# EasyEDA schematic SCH_ESP32.json
TITLE: Sheet_1; REV: 1.0; Date: 2026-06-26; Sheet: 1/1; Drawn By: bannuazmeera; Company: Your Company
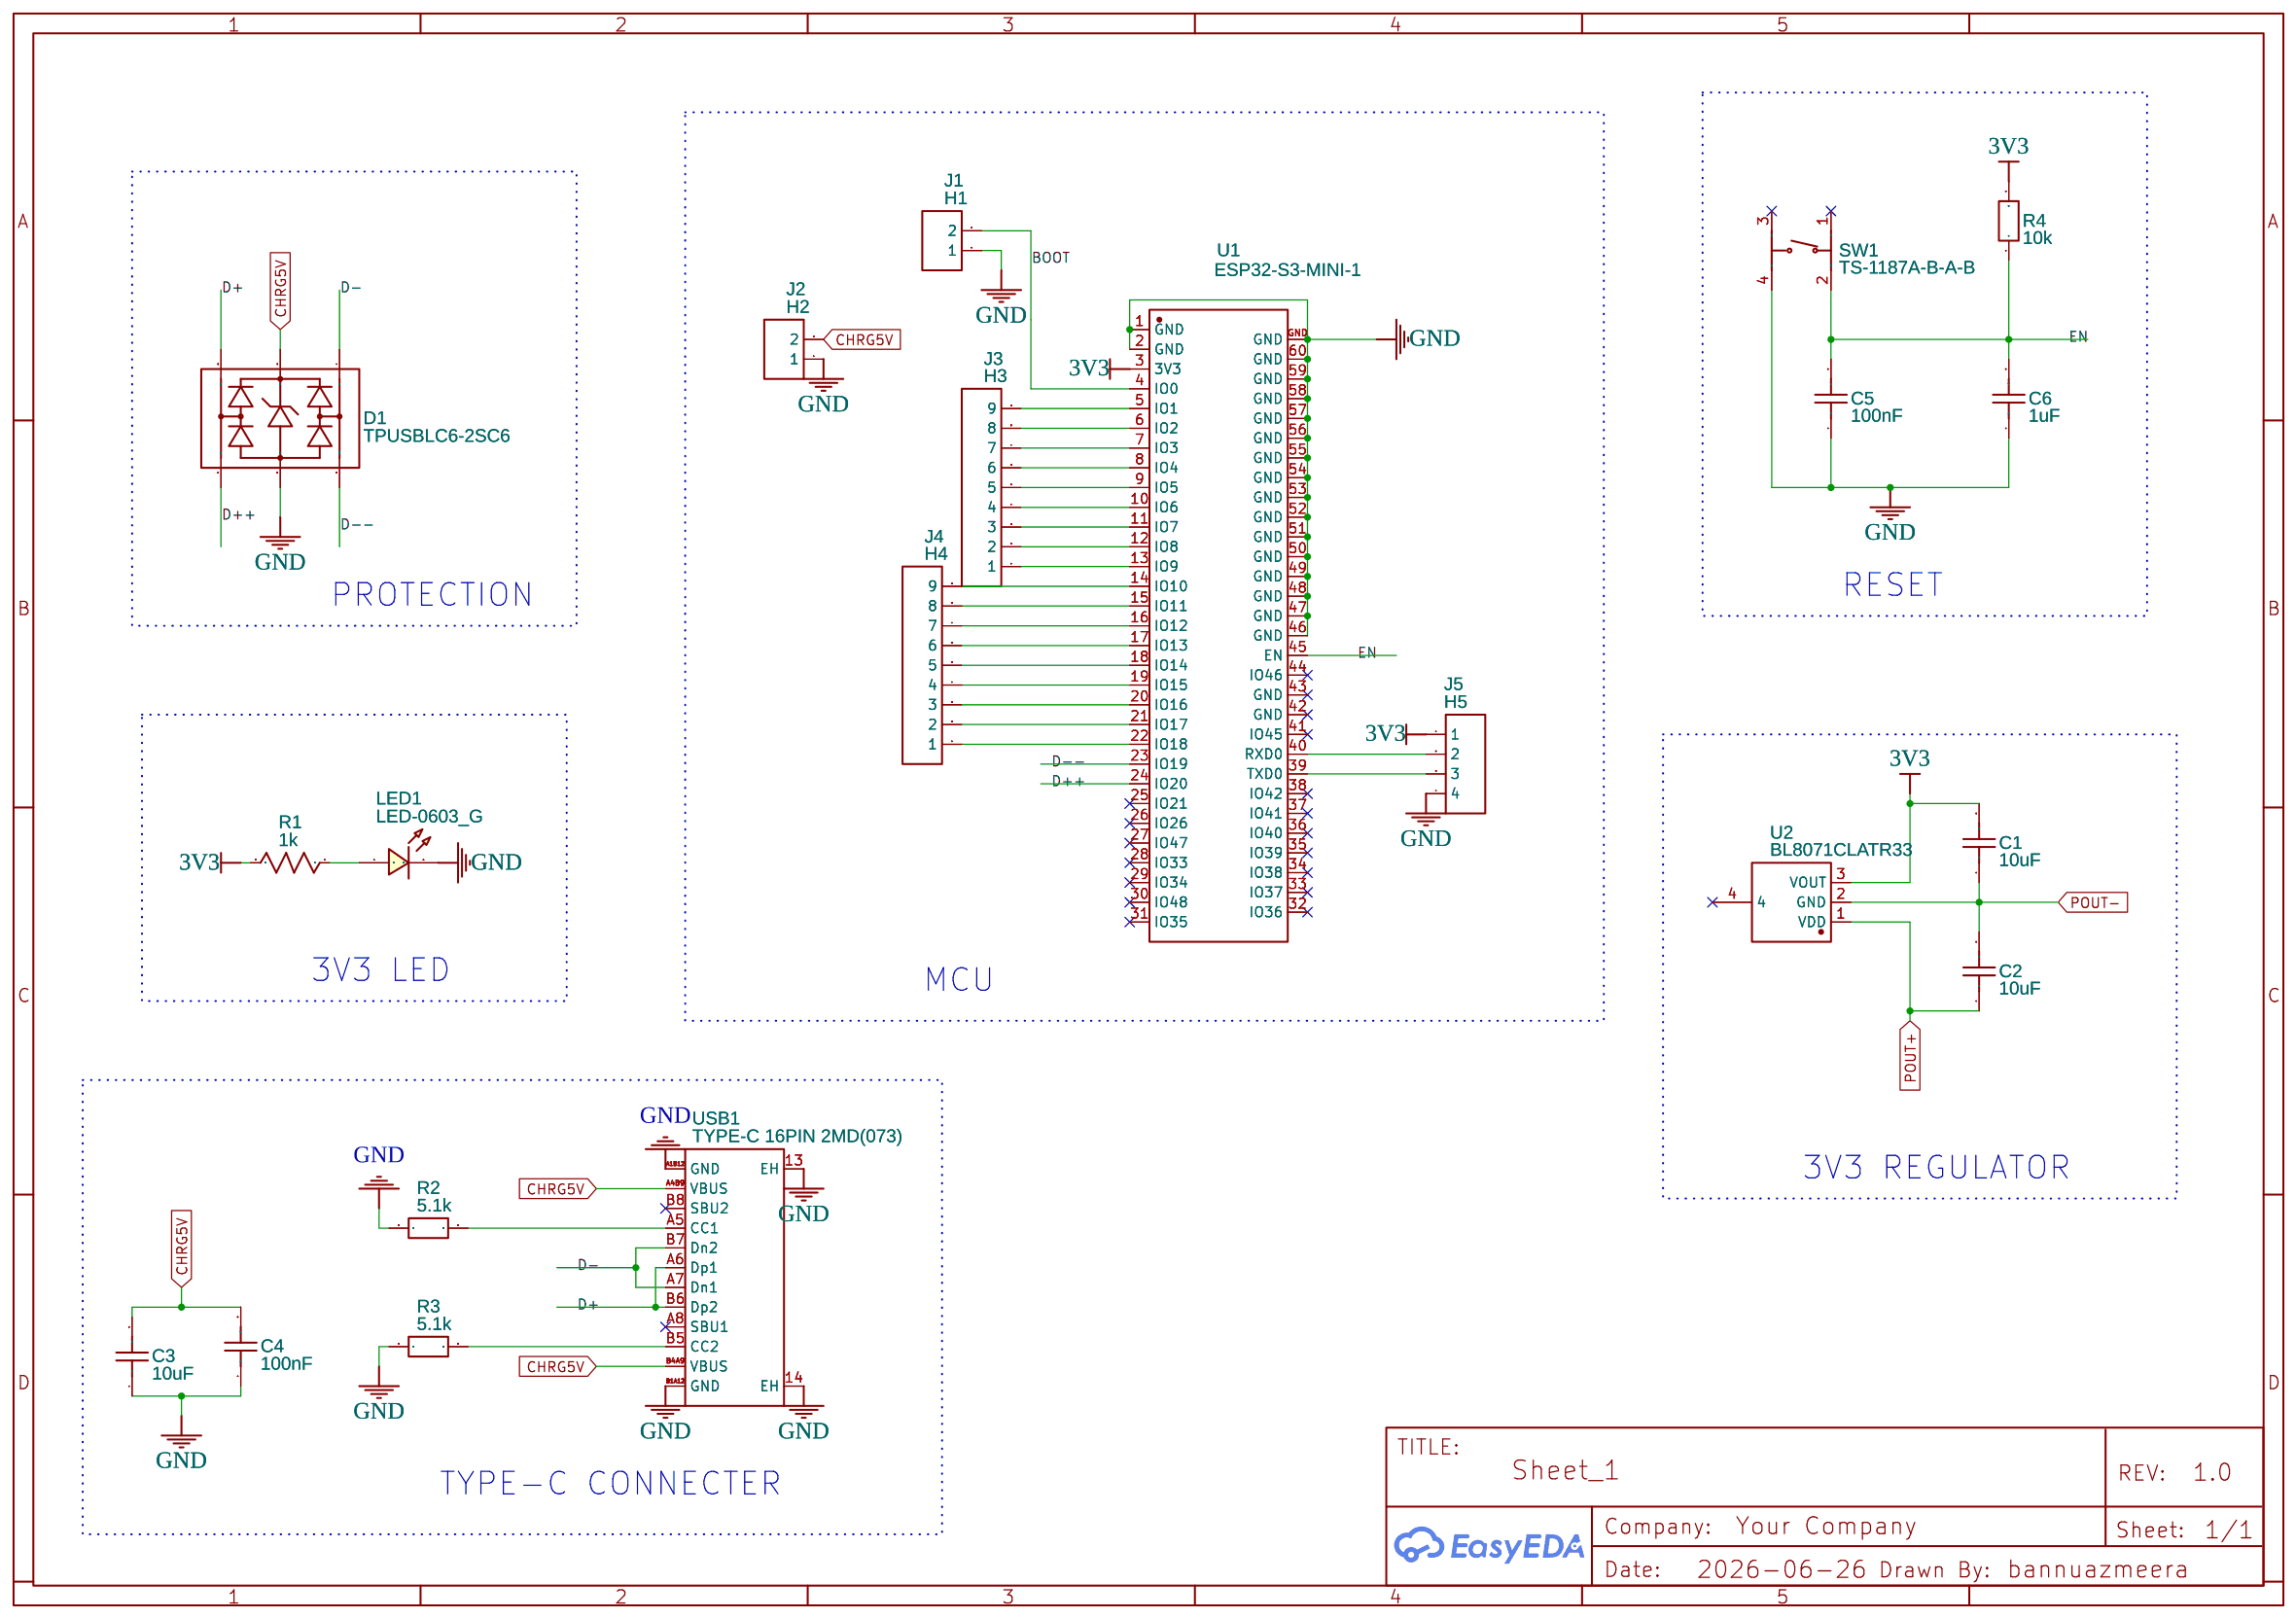
[diagram p0: schematic sheet]

## Parts
C1  10uF  [C0603]
C2  10uF  [C0603]
C3  10uF  [C0603]
C4  100nF  [C0603]
C5  100nF  [C0603]
C6  1uF  [C0603]
D1  TPUSBLC6-2SC6  [SOT-23-6_L2.9-W1.6-P0.95-LS2.8-BR]
J1  H1  [HDR-M-2.54_1X2]
J2  H2  [HDR-M-2.54_1X2]
J3  H3  [HDR-M-2.54_1X9]
J4  H4  [HDR-M-2.54_1X9]
J5  H5  [HDR-M-2.54_1X4]
LED1  LED-0603_G  [LED0603_GREEN]
R1  1k  [R0603]
R2  5.1k  [R0603]
R3  5.1k  [R0603]
R4  10k  [R0603]
SW1  TS-1187A-B-A-B  [SW-SMD_4P-L5.1-W5.1-P3.70-LS6.5-TL_H1.5]
U1  ESP32-S3-MINI-1  [BULETM-SMD_ESP32-S3-MINI-1-N8]
U2  BL8071CLATR33  [SOT-223-3_L6.5-W3.4-P2.30-LS7.0-BR]
USB1  TYPE-C 16PIN 2MD(073)  [USB-C-SMD_TYPE-C-16PIN-2MD-073]

## Library data of the parts
C1-C6 = C_0603_US: Contributor: LCEDA_Lib
D1 = TPUSBLC6-2SC6: Contributor: LCSC; Supplier: LCSC; Supplier Part: C558442; Manufacturer: TECH PUBLIC(台舟); JLCPCB Part Class: Extended Part
J1 J2 = HDR-M-2.54_1x2: Supplier Part: C124375; Supplier: LCSC; Contributor: LCEDA_Lib
J3 J4 = HDR-M-2.54_1x9: Supplier Part: C225484; Supplier: LCSC; Contributor: LCEDA_Lib
J5 = HDR-M-2.54_1x4: Supplier Part: C124378; Supplier: LCSC; Contributor: LCEDA_Lib
LED1 = LED-0603_G: Manufacturer: EVERLIGHT(台湾亿光); Manufacturer Part: 19-217/GHC-YR1S2/3T; Supplier Part: C72043; Supplier: LCSC; Contributor: LCEDA_Lib
R1 = R_0603_US: Contributor: LCEDA_Lib
R2-R4 = R_0603_EU: Contributor: LCEDA_Lib
SW1 = TS-1187A-B-A-B: Contributor: LCSC; Supplier: LCSC; Supplier Part: C318884; Manufacturer: XKB Connection(中国星坤); JLCPCB Part Class: Basic Part
U1 = ESP32-S3-MINI-1: Contributor: lcsc; Supplier: LCSC; Supplier Part: C9900015247; Manufacturer: null; JLCPCB Part Class: Extended Part
U2 = BL8071CLATR33: Contributor: LCSC; Supplier: LCSC; Supplier Part: C401677; Manufacturer: BL(上海贝岭); JLCPCB Part Class: Extended Part
USB1 = TYPE-C 16PIN 2MD(073): Contributor: LCSC; Supplier: LCSC; Supplier Part: C2765186; Manufacturer: SHOU HAN(首韩); JLCPCB Part Class: Extended Part

## Nets
3V3: C1.2 J5.1 R1.2 R4.2 U1.3(3V3) U2.3(VOUT)
GND: C3.1 C4.1 C5.1 C6.1 D1.2(GND) J1.1 J2.1 J5.4 LED1.2 R2.1 R3.1 SW1.4(D) U1.1(GND) U1.2(GND) U1.46(GND) U1.47(GND) U1.48(GND) U1.49(GND) U1.50(GND) U1.51(GND) U1.52(GND) U1.53(GND) U1.54(GND) U1.55(GND) U1.56(GND) U1.57(GND) U1.58(GND) U1.59(GND) U1.60(GND) U1.GND USB1.13(EH) USB1.14(EH) USB1.A1B12(GND) USB1.B1A12(GND)
BOOT: J1.2 U1.4(IO0)
CHRG5V: C3.2 C4.2 D1.5(VBUS) J2.2 USB1.A4B9(VBUS) USB1.B4A9(VBUS)
D+: D1.6(I/O1) USB1.A6(Dp1) USB1.B6(Dp2)
D++: D1.1(I/O1) U1.24(IO20)
D-: D1.4(I/O2) USB1.A7(Dn1) USB1.B7(Dn2)
D--: D1.3(I/O2) U1.23(IO19)
EN: C5.2 C6.2 R4.1 SW1.2(B) U1.45(EN)
POUT+: C2.1 U2.1(VDD)
POUT-: C1.1 C2.2 U2.2(GND)
Net-(J3-1): J3.1 U1.13(IO9)
Net-(J3-2): J3.2 U1.12(IO8)
Net-(J3-3): J3.3 U1.11(IO7)
Net-(J3-4): J3.4 U1.10(IO6)
Net-(J3-5): J3.5 U1.9(IO5)
Net-(J3-6): J3.6 U1.8(IO4)
Net-(J3-7): J3.7 U1.7(IO3)
Net-(J3-8): J3.8 U1.6(IO2)
Net-(J3-9): J3.9 U1.5(IO1)
Net-(J4-1): J4.1 U1.22(IO18)
Net-(J4-2): J4.2 U1.21(IO17)
Net-(J4-3): J4.3 U1.20(IO16)
Net-(J4-4): J4.4 U1.19(IO15)
Net-(J4-5): J4.5 U1.18(IO14)
Net-(J4-6): J4.6 U1.17(IO13)
Net-(J4-7): J4.7 U1.16(IO12)
Net-(J4-8): J4.8 U1.15(IO11)
Net-(J4-9): J4.9 U1.14(IO10)
Net-(J5-2): J5.2 U1.40(RXD0)
Net-(J5-3): J5.3 U1.39(TXD0)
Net-(LED1-1): LED1.1 R1.1
Net-(R2-2): R2.2 USB1.A5(CC1)
Net-(R3-2): R3.2 USB1.B5(CC2)

Not connected (* = marked no-connect by the designer): SW1 1(A)* 3(C)*; U1 25(IO21)* 26(IO26)* 27(IO47)* 28(IO33)* 29(IO34)* 30(IO48)* 31(IO35)* 32(IO36)* 33(IO37)* 34(IO38)* 35(IO39)* 36(IO40)* 37(IO41)* 38(IO42)* 41(IO45)* 42(GND)* 43(GND)* 44(IO46)*; U2 4*; USB1 A8(SBU1)* B8(SBU2)*

## Notes on the sheet
- PROTECTION
- RESET
- 3V3 LED
- MCU
- 3V3 REGULATOR
- TYPE-C CONNECTER
